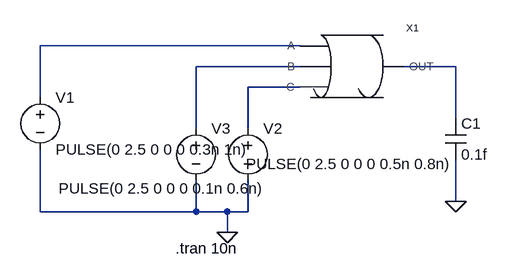
[diagram p0: schematic nor1x3sim.asc]
nor1x3sim.asc, the LTspice schematic file:
Version 4
SHEET 1 880 680
WIRE 96 64 -304 64
WIRE 96 96 -64 96
WIRE 336 96 256 96
WIRE 96 128 16 128
WIRE -304 144 -304 64
WIRE 336 176 336 96
WIRE -64 192 -64 96
WIRE 16 192 16 128
WIRE 336 304 336 240
WIRE -304 320 -304 224
WIRE -64 320 -64 272
WIRE -64 320 -304 320
WIRE -16 320 -64 320
WIRE 16 320 16 272
WIRE 16 320 -16 320
WIRE -16 352 -16 320
FLAG -16 352 0
FLAG 336 304 0
SYMBOL voltage 16 176 R0
WINDOW 3 -3 70 Left 2
WINDOW 123 0 0 Left 2
WINDOW 39 0 0 Left 2
SYMATTR Value PULSE(0 2.5 0 0 0 0.5n 0.8n)
SYMATTR InstName V2
SYMBOL voltage -64 176 R0
WINDOW 3 -212 108 Left 2
WINDOW 123 0 0 Left 2
WINDOW 39 0 0 Left 2
SYMATTR Value PULSE(0 2.5 0 0 0 0.1n 0.6n)
SYMATTR InstName V3
SYMBOL cap 320 176 R0
SYMATTR InstName C1
SYMATTR Value 0.1f
SYMBOL nor1x3 128 80 R0
SYMATTR InstName X1
SYMBOL voltage -304 128 R0
WINDOW 123 0 0 Left 2
WINDOW 39 0 0 Left 2
SYMATTR InstName V1
SYMATTR Value PULSE(0 2.5 0 0 0 0.3n 1n)
TEXT -96 376 Left 2 !.tran 10n

The netlist it stands for:
* nor1x3sim.asc
V2 N004 0 PULSE(0 2.5 0 0 0 0.5n 0.8n)
V3 N002 0 PULSE(0 2.5 0 0 0 0.1n 0.6n)
C1 N003 0 0.1f
XX1 N001 N002 N003 N004 nor1x3  ; pins A B OUT C
V1 N001 0 PULSE(0 2.5 0 0 0 0.3n 1n)
.tran 10n
.backanno
.end